# EAGLE design source_eagle (EAGLE 9.6.2)
COMPANY: ADAFRUIT INDUSTRIES; DRAWN: KTOWN; REV: A; YEAR: 2019
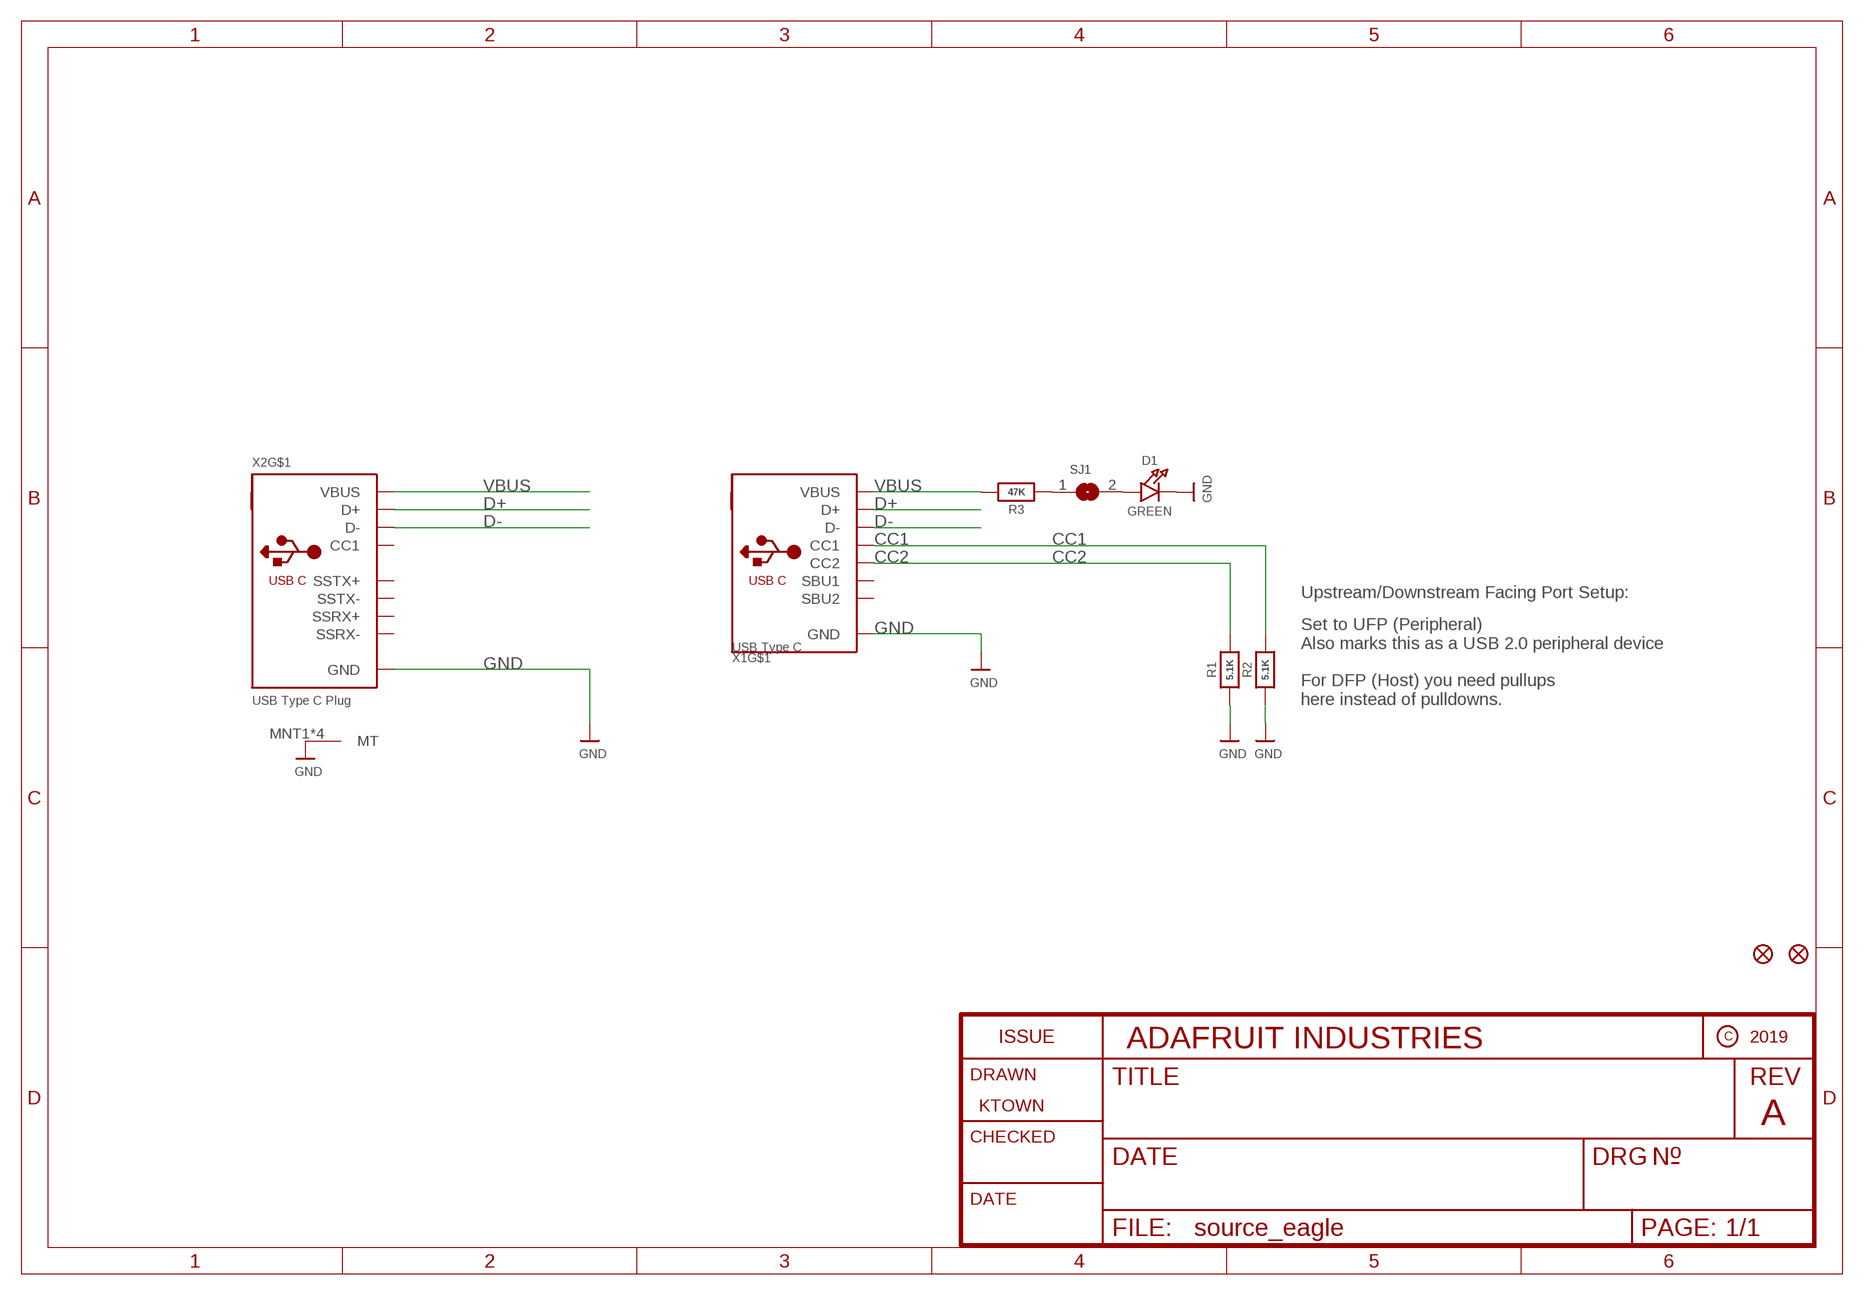
[diagram p0: schematic, sheet 1]

## Parts
D1  GREEN  LED0603_NOOUTLINE  [CHIPLED_0603_NOOUTLINE]
FID1  FIDUCIAL_0.5MM  [FIDUCIAL_0.5MM]
FID2  FIDUCIAL_0.5MM  [FIDUCIAL_0.5MM]
R1  5.1K  RESISTOR_0603_NOOUT  [0603-NO]
R2  5.1K  RESISTOR_0603_NOOUT  [0603-NO]
R3  47K  RESISTOR_0603_NOOUT  [0603-NO]
SJ1  SOLDERJUMPERCLOSED  [SOLDERJUMPER_CLOSEDWIRE]
X1  USB Type C  USB_C_SINK  [USB_C_SINK]
X2  USB Type C Plug  USB_C_PLUG_12P  [USB_TYPEC_PLUG_12P]

## Nets
CC1: R2.2 X1.A5(CC1)
CC2: R1.2 X1.B5(CC2)
D+: X1.A6(D+) X1.B6(D+) X2.A6(D+)
D-: X1.A7(D-) X1.B7(D-) X2.A7(D-)
GND: D1.C R1.1 R2.1 X1.A1B12(GND) X1.B1A12(GND) X2.A1(GND) X2.A12(GND) X2.B12(GND) X2.MNT1(MT) X2.MNT2(MT) X2.P$1(MT) X2.P$2(MT)
N$1: R3.1 SJ1.1
N$2: D1.A SJ1.2
VBUS: R3.2 X1.A4B9(VBUS) X1.B4A9(VBUS) X2.A4(VBUS) X2.B9(VBUS)
Unconnected: X1.A8(SBU1) X1.B8(SBU2) X1.M1(MT) X1.M2(MT) X1.M3(MT) X1.M4(MT) X2.A2(SSTX+) X2.A3(SSTX-) X2.A5(CC1) X2.B10(SSRX-) X2.B11(SSRX+)

## Notes on the sheet
- Upstream/Downstream Facing Port Setup:
- Set to UFP (Peripheral)
  Also marks this as a USB 2.0 peripheral device
  
  For DFP (Host) you need pullups
  here instead of pulldowns.

## Library data of the parts
D1 = microbuilder:LED: LED 0603 - 0603 Surface Mount Package 2mA: Green LED - Low Power (3.9mcd, 2ma, 1.7Vf) - Digikey: 475-2709-2-ND Orange LED - Low Power (9.8mcd, 2ma, 1.8Vf) - Digikey: 475-1194-2-ND Red LED - Low Power (5mcd, 2ma, 1.8Vf) - Digikey: 475-1195-2-ND Yellow LED - Low Power (7mcd, 2ma, 1.8Vf) - Digikey: 475-1196-2-ND 5mA: Blue LED - Low Power (17mcd, 5ma, 2.9Vf) - Digikey: LNJ937W8CRACT-ND 0805 - 0805 Surface Mount Package 2mA: Red LED (8.8mcd, 2mA, 1.8Vf, Clear) - Low Power [Digikey: 475-2510-1-ND] Green LED (5mcd, 2mA, 1.8Vf, Clear) - Low Power [Digikey: 475-2730-1-ND] Yellow LED (11.3mcd, 2mA, 1.8Vf, Clear) - Low Power [Digikey: 475-2555-1-ND] 20mA: Red LED (104mcd, 20mA, Diffused) - LS R976 [Digikey: 475-1278-6-ND] Red LED (12mcd, 20mA, 2.0Vf, Clear) - APT2012EC [Digikey: 754-1128-1-ND] Green LED (15mcd, 20mA, 2.2Vf, Clear) - APT2012GC [Digikey: 754-1131-1-ND] Orange LED (160mcd, 20mA, 2.1Vf, Clear) - APT2012SECK [Digikey: 754-1130-1-ND] 1206 - 1206 Surface Mount Package Green LED (26mcd, 20mA, Diffused) - LG N971 [Digikey: 475-1407-6-ND] Red LED (15mcd, 20mA, Diffused) - LH N974 [Digikey: 475-1416-6-ND] Cree - Cree High-Power Surface Mount LEDs XPEBWT-L1-0000-00D50 - White 111lm 350mA 2.9Vf 6200K 110° XTEAWT-00-0000-00000LEE3 - White 114lm 350mA 2.85Vf 5000K 115° Everlight - Everlight 45-21 Series Surface Mount LEDs 45-21/QK2C-B2832AC2CB2/2T - Warm White 2000mcd 20mA 3.25Vf 3050K 120° 45-21/LK2C-B38452C4CB2/2T - Nuetral White 2000mcd 20mA 3.25Vf 4150K 120° 45-21/LK2C-B50634C6CB2/2T - Cold White 2200mcd 20mA 3.25Vf 5650K 120° PLCC2 Reverse Mount LS T77K-J1L2-1-0-2-R18-Z - Red 11.25mcd 2mA 1.8Vf 630nm 120° LO T77K-L1M2-24-Z - Orange 19.6mcd 2mA 1.8Vf 606nm 120° LY T77K-K2M1-26-Z - Yellow 15.7mcd 2mA 1.8Vf 587nm 120°; ROT: 270
FID1 FID2 = microbuilder:FIDUCIAL: Fiducial Alignment Points Various fiducial points for machine vision alignment.
R1-R3 = microbuilder:RESISTOR: Resistors For new designs, use the packages preceded by an '_' character since they are more reliable: The following footprints should be used on most boards: _0402 - Standard footprint for regular board layouts _0603 - Standard footprint for regular board layouts _0805 - Standard footprint for regular board layouts _1206 - Standard footprint for regular board layouts For extremely tight-pitch boards where space is at a premium, the following 'micro-pitch' footprints can be used (smaller pads, no silkscreen outline, etc.): _0402MP - Micro-pitch footprint for very dense/compact boards _0603MP - Micro-pitch footprint for very dense/compact boards _0805MP - Micro-pitch footprint for very dense/compact boards _1206MP - Micro-pitch footprint for very dense/compact boards
SJ1 = microbuilder:SOLDERJUMPER: SMD Solder JUMPER Solder the two pads together to create a connection, or remove the solder to break it. REFLOW - Use this footprint for solder paste and reflow ovens. WAVE - Use this footprint for hand-soldering (larger pads). CLOSED - Has a trace between the two pads to ensure it is closed by default. The trace needs to be cut to disable the jumper, and can be closed again by creating a solder bridge between the two pads.
X1 = adafruit_electromech:USB_C: USB Type-C USB 2.0 Connector
X2 = adafruit_electromech:USB_C_PLUG_12P: USB Type-C USB 2.0 Connector

## Board
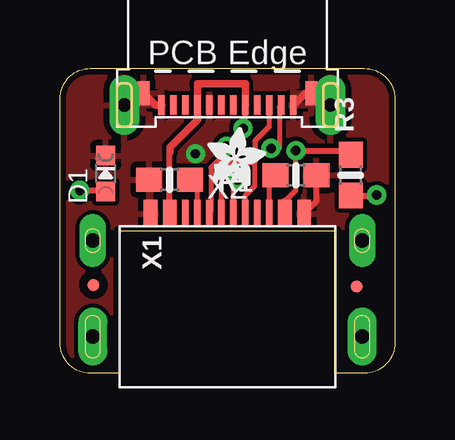
[diagram p1: board, top side]
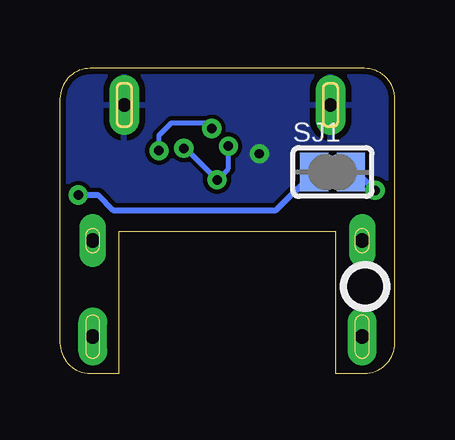
[diagram p2: board, bottom side, seen from below]

Size 13.97 x 12.7 mm. Coordinates in mm from the lower left corner, seen from the top.
Outline: 1.27,12.7 12.7,12.7 arc-90 13.97,11.43 13.97,1.27 arc-90 12.7,0 11.49,0 11.49,5.91 2.48,5.91 2.48,0 1.27,0 arc-90 0,1.27 0,11.43 arc-90 1.27,12.7
Copper layers (1*16): Top 0.035mm / dielectric 1.5mm / Bottom 0.035mm
Design rules "adafruit 7-7": minimum track width 7mil, minimum drill 15.5mil, track to track 7mil, track to pad 7mil, pad to pad 7mil, via to via 7mil, smd to smd 7mil, copper to edge 10mil, drill to drill 8mil, minimum pad ring 10mil, minimum via ring 8mil, stop-mask expansion 2mil, vias tented up to drill 20mil, thermal gap 10mil

### Footprints (pad centres in the part's own frame; a part is rotated, then mirrored left to right if it is on the bottom)
CHIPLED_0603_NOOUTLINE = smd 0.8 x 0.8: A 0,-0.75; C 0,0.75
FIDUCIAL_0.5MM = smd 0.5 x 0.5: 1 0,0
0603-NO = smd 1.075 x 1: 1 -0.85,0; 2 0.85,0
SOLDERJUMPER_CLOSEDWIRE = smd 1.168 x 1.6: 1 -0.762,0; 2 0.762,0 | smd 0.635 x 0.203: WIRE 0,0
USB_C_SINK = smd 0.575 x 1.15: A1B12 -3.2,2.585; A4B9 -2.4,2.585; B1A12 3.2,2.585; B4A9 2.4,2.585 | smd 0.275 x 1.15: A5 -1.25,2.585; A6 -0.25,2.585; A7 0.25,2.585; A8 1.25,2.585; B5 1.75,2.585; B6 0.75,2.585; B7 -0.75,2.585; B8 -1.75,2.585 | drill 0.6 pad 1 long: M1 -5.62,1.46; M2 5.62,1.46 | drill 0.6 pad 1.2 long: M3 -5.62,-2.54; M4 5.62,-2.54
USB_TYPEC_PLUG_12P = smd 0.275 x 0.8: A1 2.75,0; A2 2.25,0; A3 1.75,0; A4 1.25,0; A5 -1.25,0; A6 -1.75,0; A7 -2.25,0; A12 -2.75,0; B9 -0.75,0; B10 -0.25,0; B11 0.25,0; B12 0.75,0 | drill 0.55 pad 1.25 long: MNT1 -4.3,0; MNT2 4.3,0 | smd 0.5 x 1: P$1 3.5,-0.5; P$2 -3.5,-0.5

### Placement (x,y rotation side)
D1  1.91,8.32 0 top
FID1  1.4,3.68 180 top
FID2  12.38,3.62 180 top
PLABEL0  [PLABEL0]  1.78,9.78 90 top
PLABEL1  [PLABEL1]  13.59,9.78 90 top
PLABEL2  [PLABEL2]  6.99,8.83 0 bottom
R1  9.84,8.26 180 top
R2  4.57,8.06 0 top
R3  12.13,8.26 90 top
SJ1  2.6,8.38 0 bottom
U$3  [ADAFRUIT_2.5MM]  6.16,7.81 0 top
U$8  [PCBFEAT-REV-040]  1.24,3.61 180 bottom
X1  6.99,4.06 0 top
X2  6.99,11.18 180 top

### Tracks (layer width: path | path; a pad name or v marks a point on that pad's centre or on a via)
CC1
  Top 0.203: X1.A5 5.74,7.75 R2.2
CC2
  Top 0.203: X1.B5 8.73,8 R1.2
D+
  Top 0.203: X1.A6 6.74,8.39 7.11,8.76 8.13,8.76 | X2.A6 8.73,10.29 8.13,9.68 8.13,8.76 | X1.B6 7.74,7.42 8.13,7.81 8.13,8.76
D-  (via drill 0.39)
  Top 0.203: X1.A7 7.24,7.88 v7.41,8.06 | v6.95,9.46 6.95,9.21 6.3,8.56 6.3,6.71 X1.B7 | X2.A7 9.15,11.09 9.15,9.37 v8.81,9.37
  Bottom 0.203: v6.95,9.46 6.95,8.53 v7.41,8.06 8.77,9.41 v8.81,9.37
GND  (via drill 0.39)
  Top 0.254: X1.B1A12 10.69,7.16 R1.1
  Top 0.305: X2.A1 3.98,11.18 X2.P$1 3.19,11.68 X2.MNT2 | X2.A12 10.23,11.68 X2.P$2 10.79,11.68 X2.MNT1
  other vias: 5.65,9.14
  pour Top: 0,12.7 13.97,12.7 13.97,0 0,0
  pour Bottom: 0,12.7 13.97,12.7 13.97,0 0,0
N$1  (via drill 0.39)
  Top 0.254: R3.1 13.18,7.41 v13.21,7.43
  Bottom 0.254: v13.21,7.43 12.38,7.43 11.75,6.79 4.95,6.79 SJ1.1
N$2  (via drill 0.39)
  Top 0.254: v0.83,7.62 1.85,7.62 D1.A
  Bottom 0.254: SJ1.2 1.59,8.38 v0.83,7.62
VBUS  (via drill 0.39)
  Top 0.203: 9.38,7.16 9.84,7.62 v9.84,9.27 | v7.64,10.2 7.74,10.29 X2.B9
  Top 0.254: X1.A4B9 4.58,9.21 4.58,9.22 | v9.84,9.27 11.96,9.27 R3.2
  Top 0.305: X2.B9 7.74,12.06 5.74,12.06 X2.A4 5.74,10.56 4.58,9.41 4.58,9.22 | X1.B4A9 9.38,7.16
  Bottom 0.203: v9.84,9.27 9.84,9.91 9.32,10.43 7.87,10.43 v7.64,10.2

### Text on the board
Pinguin_tBackup: CC | Fix
Pinguin_bBackup: USB C / CC resistor / PD Fixer